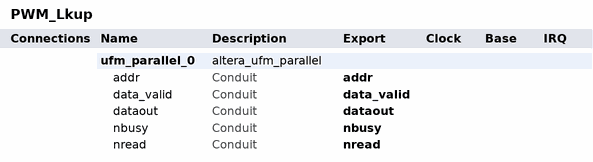
[diagram p0: system contents]
# Platform Designer (Qsys) system PWM_Lkup, MAX V 5M2210ZF256C5
# Parameters at their usual value, and those the tool derives, are not listed.
package require -exact qsys 18.1
create_system PWM_Lkup
set_project_property DEVICE_FAMILY {MAX V}
set_project_property DEVICE 5M2210ZF256C5

add_instance ufm_parallel_0 altera_ufm_parallel 18.1
set_instance_property ufm_parallel_0 AUTO_EXPORT true
set_instance_parameter_value ufm_parallel_0 ACCESS_MODE READ_ONLY
set_instance_parameter_value ufm_parallel_0 CBX_AUTO_BLACKBOX ALL
set_instance_parameter_value ufm_parallel_0 GUI_ERASE_TIME 500000
set_instance_parameter_value ufm_parallel_0 GUI_MEM_INIT {Initialize from hex or mif file}
set_instance_parameter_value ufm_parallel_0 GUI_OSC_FREQUENCY 5.56
set_instance_parameter_value ufm_parallel_0 GUI_PROGRAM_TIME 1600
set_instance_parameter_value ufm_parallel_0 LPM_FILE {C:/Users/jjo/OneDrive - SLAC National Accelerator Laboratory/TID_AIR/Projects/MissionReadiness/RfInterlocks/Altera_C02/RFInterlockRTM_a/PWM_GEN_HEX.mif}
set_instance_parameter_value ufm_parallel_0 OSCENA_CHECK false
set_instance_parameter_value ufm_parallel_0 OSC_CHECK false
set_instance_parameter_value ufm_parallel_0 WIDTH_ADDRESS 9
set_instance_parameter_value ufm_parallel_0 WIDTH_DATA 16
set_instance_parameter_value ufm_parallel_0 WIDTH_UFM_ADDRESS 9

# exported interfaces
add_interface addr conduit end
set_interface_property addr EXPORT_OF ufm_parallel_0.addr
add_interface data_valid conduit end
set_interface_property data_valid EXPORT_OF ufm_parallel_0.data_valid
add_interface dataout conduit end
set_interface_property dataout EXPORT_OF ufm_parallel_0.dataout
add_interface nbusy conduit end
set_interface_property nbusy EXPORT_OF ufm_parallel_0.nbusy
add_interface nread conduit end
set_interface_property nread EXPORT_OF ufm_parallel_0.nread

set_interconnect_requirement {$system} qsys_mm.clockCrossingAdapter HANDSHAKE
set_interconnect_requirement {$system} qsys_mm.enableEccProtection FALSE
set_interconnect_requirement {$system} qsys_mm.insertDefaultSlave FALSE
set_interconnect_requirement {$system} qsys_mm.maxAdditionalLatency 1

save_system PWM_Lkup.qsys
